# Altium schematic sheet CPLD.SchDoc
size A4
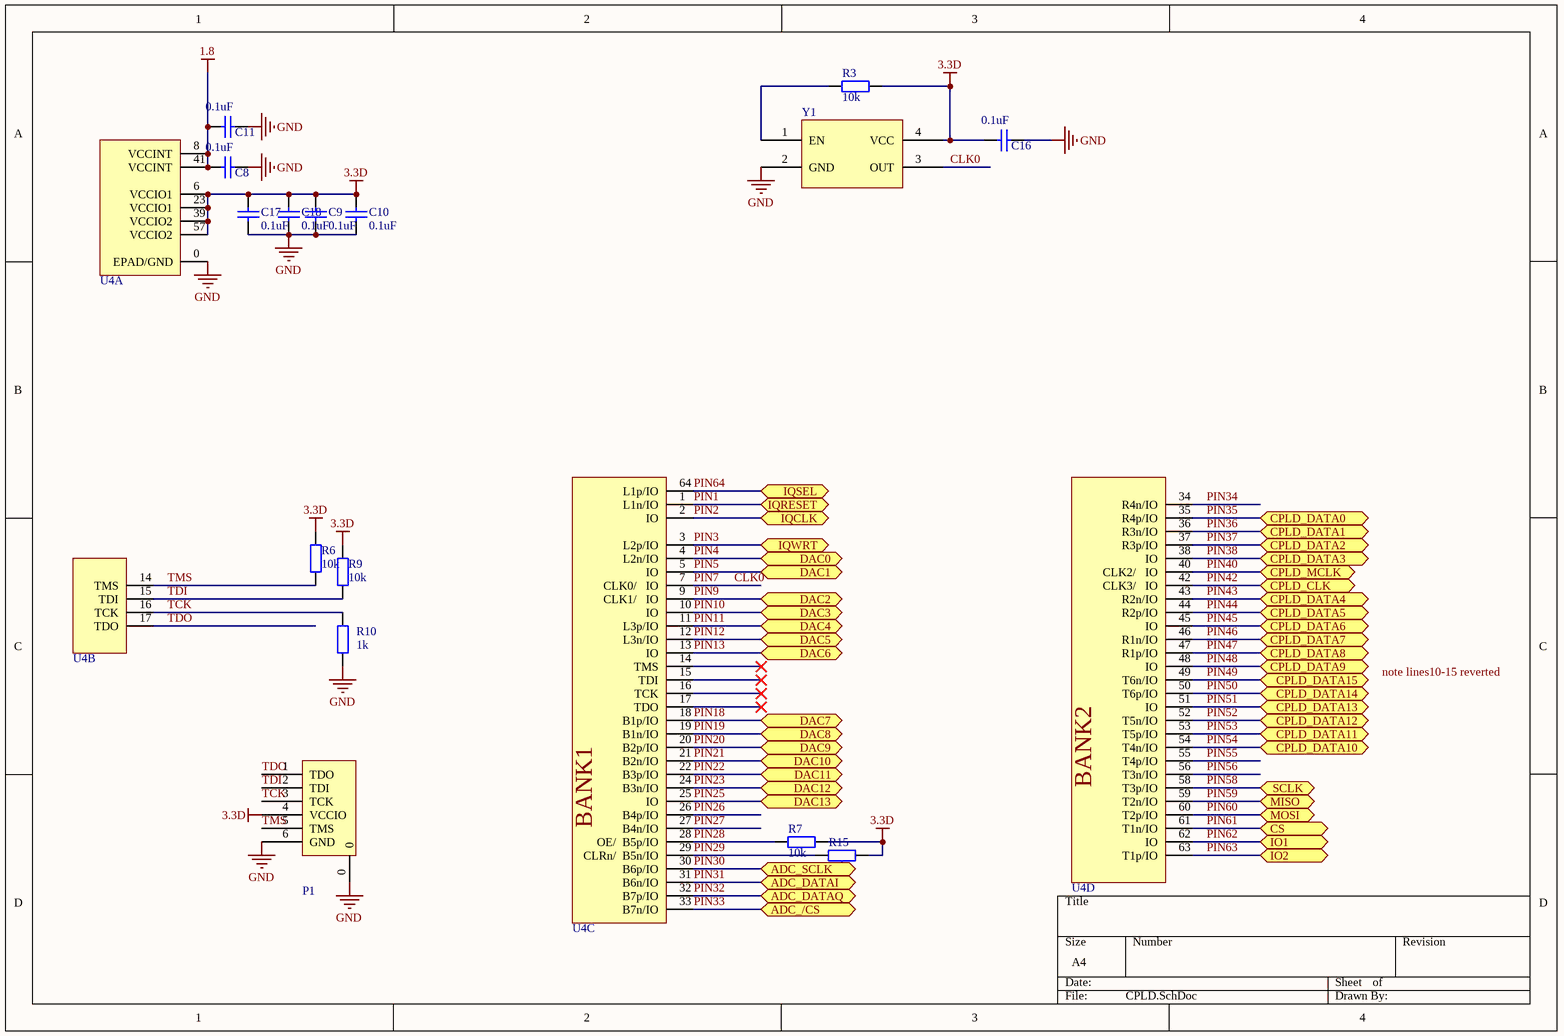
[diagram p0: CPLD.SchDoc]

## Parts
C8  0.1uF  [0402]
C9  0.1uF  [0402]
C10  0.1uF  [0402]
C11  0.1uF  [0402]
C16  0.1uF  [0402]
C17  0.1uF  [0402]
C18  0.1uF  [0402]
P1  JTAG-6P  [GH1.25-6]  (value not drawn)
R3  10k  [0402]
R6  10k  [0402]
R7  10k  [0402]
R9  10k  [0402]
R10  1k  [0402]
R15  10k  [0402]
U4  5M160ZE64  [5M160ZE64]  (value not drawn)  (parts A,B,C,D of 4)
Y1  OSC_50M  [TXC_7Q]  (value not drawn)

## Ports
ADC_/CS, ADC_DATAI, ADC_DATAQ, ADC_SCLK, CPLD_CLK, CPLD_DATA0, CPLD_DATA1, CPLD_DATA2, CPLD_DATA3, CPLD_DATA4, CPLD_DATA5, CPLD_DATA6, CPLD_DATA7, CPLD_DATA8, CPLD_DATA9, CPLD_DATA10, CPLD_DATA11, CPLD_DATA12, CPLD_DATA13, CPLD_DATA14, CPLD_DATA15, CPLD_MCLK, CS, DAC0, DAC1, DAC2, DAC3, DAC4, DAC5, DAC6, DAC7, DAC8, DAC9, DAC10, DAC11, DAC12, DAC13, IO1, IO2, IQCLK, IQRESET, IQSEL, IQWRT, MISO, MOSI, SCLK

## Nets
1.8: C8.2 C11.2 U4.8(VCCINT) U4.41(VCCINT)
3.3D: C9.2 C10.2 C16.2 C17.2 C18.2 P1.4(VCCIO) R3.2 R6.2 R7.2 R9.2 R15.2 U4.6(VCCIO1) U4.23(VCCIO1) U4.39(VCCIO2) U4.57(VCCIO2) Y1.4(VCC)
GND: C8.1 C9.1 C10.1 C11.1 C16.1 C17.1 C18.1 P1.0 P1.6(GND) R10.1 U4.0(EPAD/GND) Y1.2(GND)
CLK0: U4.7(CLK0/___IO) Y1.3(OUT)  [also labelled PIN7]
PIN1: U4.1(L1n/IO) ; port IQRESET
PIN2: U4.2(IO) ; port IQCLK
PIN3: U4.3(L2p/IO) ; port IQWRT
PIN4: U4.4(L2n/IO) ; port DAC0
PIN5: U4.5(IO) ; port DAC1
PIN9: U4.9(CLK1/___IO) ; port DAC2
PIN10: U4.10(IO) ; port DAC3
PIN11: U4.11(L3p/IO) ; port DAC4
PIN12: U4.12(L3n/IO) ; port DAC5
PIN13: U4.13(IO) ; port DAC6
PIN18: U4.18(B1p/IO) ; port DAC7
PIN19: U4.19(B1n/IO) ; port DAC8
PIN20: U4.20(B2p/IO) ; port DAC9
PIN21: U4.21(B2n/IO) ; port DAC10
PIN22: U4.22(B3p/IO) ; port DAC11
PIN23: U4.24(B3n/IO) ; port DAC12
PIN25: U4.25(IO) ; port DAC13
PIN26: U4.26(B4p/IO)
PIN27: U4.27(B4n/IO)
PIN28: R7.1 U4.28(OE/__B5p/IO)
PIN29: R15.1 U4.29(CLRn/__B5n/IO)
PIN30: U4.30(B6p/IO) ; port ADC_SCLK
PIN31: U4.31(B6n/IO) ; port ADC_DATAI
PIN32: U4.32(B7p/IO) ; port ADC_DATAQ
PIN33: U4.33(B7n/IO) ; port ADC_/CS
PIN34: U4.34(R4n/IO)
PIN35: U4.35(R4p/IO) ; port CPLD_DATA0
PIN36: U4.36(R3n/IO) ; port CPLD_DATA1
PIN37: U4.37(R3p/IO) ; port CPLD_DATA2
PIN38: U4.38(IO) ; port CPLD_DATA3
PIN40: U4.40(CLK2/___IO) ; port CPLD_MCLK
PIN42: U4.42(CLK3/___IO) ; port CPLD_CLK
PIN43: U4.43(R2n/IO) ; port CPLD_DATA4
PIN44: U4.44(R2p/IO) ; port CPLD_DATA5
PIN45: U4.45(IO) ; port CPLD_DATA6
PIN46: U4.46(R1n/IO) ; port CPLD_DATA7
PIN47: U4.47(R1p/IO) ; port CPLD_DATA8
PIN48: U4.48(IO) ; port CPLD_DATA9
PIN49: U4.49(T6n/IO) ; port CPLD_DATA15
PIN50: U4.50(T6p/IO) ; port CPLD_DATA14
PIN51: U4.51(IO) ; port CPLD_DATA13
PIN52: U4.52(T5n/IO) ; port CPLD_DATA12
PIN53: U4.53(T5p/IO) ; port CPLD_DATA11
PIN54: U4.54(T4n/IO) ; port CPLD_DATA10
PIN55: U4.55(T4p/IO)
PIN56: U4.56(T3n/IO)
PIN58: U4.58(T3p/IO) ; port SCLK
PIN59: U4.59(T2n/IO) ; port MISO
PIN60: U4.60(T2p/IO) ; port MOSI
PIN61: U4.61(T1n/IO) ; port CS
PIN62: U4.62(IO) ; port IO1
PIN63: U4.63(T1p/IO) ; port IO2
PIN64: U4.64(L1p/IO) ; port IQSEL
TCK: P1.3(TCK) R10.2 U4.16(TCK)
TDI: P1.2(TDI) R9.1 U4.15(TDI)
TDO: P1.1(TDO) U4.17(TDO)
TMS: P1.5(TMS) R6.1 U4.14(TMS)
NetR3_1: R3.1 Y1.1(EN)

## Notes on the sheet
- Labels drawn without touching a wire or pin: note lines10-15 reverted
- (in symbol 5M160ZE64, part C) BANK1
- (in symbol 5M160ZE64, part D) BANK2

## Library data of the parts
C8-C11 C16-C18 = Cap: Capacitor; Published: 8-Jun-2000; LatestRevisionDate: 17-Jul-2002; LatestRevisionNote: Re-released for DXP Platform.; PackageReference: RAD-0.3; Publisher: Altium Limited; PackageDescription: Radial Cap, Thru-Hole; 2 Leads; 0.3 in Pin Spacing
R3 R6 R7 R9 R10 R15 = Res2: Resistor; Published: 8-Jun-2000; LatestRevisionDate: 17-Jul-2002; LatestRevisionNote: Re-released for DXP Platform.; PackageReference: AXIAL-0.4; Publisher: Altium Limited; PackageDescription: Axial Device, Thru-Hole; 2 Leads; 0.4 in Pin Spacing